# Altium project MainFCC_PCB.PrjPcb (part 2 of 2)

## Sheet Test.SchDoc: Test
size A4; SheetNumber: 12; SheetTotal: 13
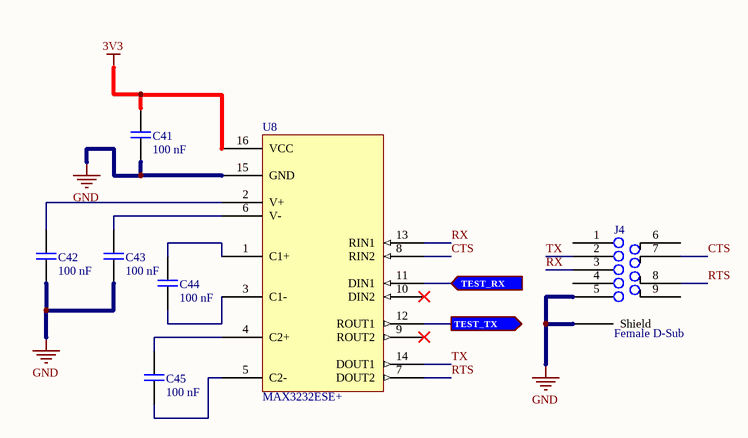
[diagram p9: Test.SchDoc]

### Parts
C41  100 nF  [MergenElektronik_Capacitors_Ceramics_SMDs_0603_M_NS]
C42  100 nF  [MergenElektronik_Capacitors_Ceramics_SMDs_0603_M_NS]
C43  100 nF  [MergenElektronik_Capacitors_Ceramics_SMDs_0603_M_NS]
C44  100 nF  [MergenElektronik_Capacitors_Ceramics_SMDs_0603_M_NS]
C45  100 nF  [MergenElektronik_Capacitors_Ceramics_SMDs_0603_M_NS]
J4  Female D-Sub  [MergenElektronik_Libraries_Connectors_D-Sub_9Position]
U8  MAX3232ESE+  [MergenElektronik_Interfaces_RS232s_SOIC-16]

### Ports
TEST_RX (in, see Microcontroller[4B]), TEST_TX (out, see Microcontroller[3B])

### Nets
3V3: C41.1 U8.16(VCC)
GND: C41.2 C42.2 C43.2 J4.5 J4.Shield U8.15(GND)
CTS: J4.7 U8.8(RIN2)
RTS: J4.8 U8.7(DOUT2)
RX: J4.3 U8.13(RIN1)
TX: J4.2 U8.14(DOUT1)
NetC42_1: C42.1 U8.2(V+)
NetC43_1: C43.1 U8.6(V-)
NetC44_1: C44.1 U8.1(C1+)
NetC44_2: C44.2 U8.3(C1-)
NetC45_1: C45.1 U8.4(C2+)
NetC45_2: C45.2 U8.5(C2-)
NetJ1_3: U8.12(ROUT1) ; port TEST_TX
NetJ1_6: U8.11(DIN1) ; port TEST_RX

Not connected (* = marked no-connect by the designer): J4 1 4 6 9; U8 9(ROUT2)* 10(DIN2)*

### Notes on the sheet
- Title:
- Size:
- Date:
- A4
- Number:
- Time:
- Revision:
- Sheet
- of
- Project
- Drawn By :

### Library data of the parts
C41-C45 = MergenElektronik_Capacitors_Ceramic_SMDs_100nF_100V: Mergen Elektronik - Capacitors - Ceramics - SMDs - 0603 - 100 nF - 100V; Manufacturer: Samsung Electro-Mechanics; Manufacturer Number: CL10B104KC8NNNC; Model: Ceramic Capacitors; Tolerance: ±10%; Value: 100 nF; Temperature: -55°C up to +125°C; Digi-Key Number: 1276-6807-1-ND; Package: 0603(1608 Metric); Mouser Number: 187-CL10B104KC8NNNC; Mounting Type: Surface Mount; Farnell Number: 3013412; Özdisan Number: CL10B104KC8NNNC; Supplier 1: Digikey; Supplier 2: Mouser; Supplier Part Number 1: 1276-6807-1-ND; Supplier Part Number 2: 187-CL10B104KC8NNNC; Voltage Rating: 100V
J4 = MergenElekttronik_Connectors_D-Sub_Female_9Position: Mergen Elektronik - Connectors - D-Sub - Female 9 Position; Manufacturer: Assmann WSW Components; Manufacturer Number: A-DF 09 A/KG-T2S; Model: D-Sub 9 Position Female Connector; Value: A-DF 09 A/KG-T2S; Number of Postion: 9; Current Rating: 3A; Voltage Rating: 250V; Connector Style: D-Sub; Number of Rows: 2; Connector Type: Female; Temperature: -55°C up to 105°C; Mounting Type: THT; Digi-Key Number: AE10921-ND; Supplier 1: Digi-kEY; Supplier Part Number 1: AE10921-ND
U8 = MergenElektronik_Interfaces_RS232s_MAX3232ESE+: Mergen Elektronik - Interfaces - RS232s - MAX3232ESE+; Manufacturer: Analog Devices Inc./Maxim Integrated; Model: RS232 Interfaces; Protocol: RS232; Operating Supply Voltage: 3V up to 5.5V; Manufacturer Number: MAX3232ESE+; Value: MAX3232ESE+; Mounting Type: Surface Mount; Package: SOIC-16; Temperature: -40°C up to 85°C; Mouser Number: 700-MAX3232ESE; Farnell Number: 2519459; Supplier 1: Digi-Key; Supplier Part Number 1: MAX3232ESE+-ND; Supplier 2: Mouser; Supplier Part Number 2: 700-MAX3232ESE; Digi-Key Number: MAX3232ESE+-ND

## Sheet MOSFETs.SchDoc: MOSFETs
size A4; SheetNumber: 13; SheetTotal: 13
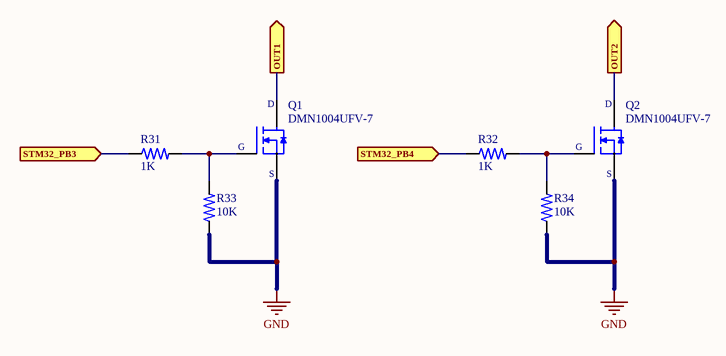
[diagram p10: MOSFETs.SchDoc]

### Parts
Q1  DMN1004UFV-7  [MergenElektronik_Transistors_Mosfets_8-PowerVDFN]
Q2  DMN1004UFV-7  [MergenElektronik_Transistors_Mosfets_8-PowerVDFN]
R31  1K  [MergenElektronik_Resistors_ChipResistors_0603_M_NS]
R32  1K  [MergenElektronik_Resistors_ChipResistors_0603_M_NS]
R33  10K  [MergenElektronik_Resistors_ChipResistors_0603_M_NS]
R34  10K  [MergenElektronik_Resistors_ChipResistors_0603_M_NS]

### Ports
OUT1 (out), OUT2 (out), STM32_PB3 (in, see Microcontroller[3C]), STM32_PB4 (in, see Microcontroller[3C])

### Nets
GND: Q1.2,_3,_4(Source) Q2.2,_3,_4(Source) R33.1 R34.1
NetQ1_1: Q1.1(Gate) R31.2 R33.2
NetQ1_5: Q1.5(Drain) ; port OUT1
NetQ2_1: Q2.1(Gate) R32.2 R34.2
NetQ2_5: Q2.5(Drain) ; port OUT2
NetR31_1: R31.1 ; port STM32_PB3
NetR32_1: R32.1 ; port STM32_PB4

### Notes on the sheet
- Title:
- Size:
- Date:
- A4
- Number:
- Time:
- Revision:
- Sheet
- of
- Project
- Drawn By :
- (in symbol MergenElektronik_Transistors_Mosfets_DMN1004UFV-7) D; G; S

### Library data of the parts
Q1 Q2 = MergenElektronik_Transistors_Mosfets_DMN1004UFV-7: Mergen Elektronik - Transistors - Mosfets - DMN1004UFV-7; Manufacturer: onsemi; Voltage Rating: 12V; Model: Mosfet; Id: 70A; Value: DMN1004UFV-7; Temperature: -55°C up to +150°C (TJ); Digi-Key Number: DMN1004UFV-7DITR-ND; Manufacturer Number: DMN1004UFV-7; Package: 8-PowerVDFN; Mounting Type: Surface Mount; Vdss: 12V; Rating Current: 70A; Mouser Number: 621-DMN1004UFV-7; Farnell Number: 3518380; Supplier 1: Digi-Key; Supplier 2: Mouser; Supplier Part Number 1: DMN1004UFV-7; Supplier Part Number 2: 621-DMN1004UFV-7; Current Rating: 70A
R31 R32 = MergenElektronik_Resistors_ChipResistors_0603_1K: Mergen Elektronik - Resistors - Chip Resistors - 0603 - 1K; Manufacturer: Stackpole Electronics Inc; Manufacturer Number: RMCF0603JT1K00; Value: Chip Resistor - 0603 - 1K; Power: 1/10W; Tolerance: ±5%; Package: 0603(1608); Temperature: -55°C up to +155°C - X8R; Model: Chip Resistor; Digi-Key Number: RMCF0603JT1K00CT-ND; Mounting Type: Surface Mount; Mouser Number: 708-RMCF0603JT1K00; Supplier 1: Digikey; Supplier 2: Mouser; Supplier Part Number 1: RMCF0603JT1K00DKR-ND; Supplier Part Number 2: 708-RMCF0603JT1K00
R33 R34 = MergenElektronik_Resistors_ChipResistors_0603_10K: Mergen Elektronik - Resistors - Chip Resistors - 0603 - 10K; Manufacturer: Stackpole Electronics Inc; Manufacturer Number: RMCF0603JT10K0; Value: Chip Resistor - 0603 - 10K; Power: 1/10W; Tolerance: ±5%; Package: 0603(1608); Temperature: -55°C up to +155°C - X8R; Model: Chip Resistor; Digi-Key Number: RMCF0603JT10K0CT-ND; Mounting Type: Surface Mount; Supplier 1: Digi-Key; Supplier Part Number 1: RMCF0603JT10K0-ND

## Sheet Descriptions.SchDoc
size A4; SheetNumber: 2; SheetTotal: 13
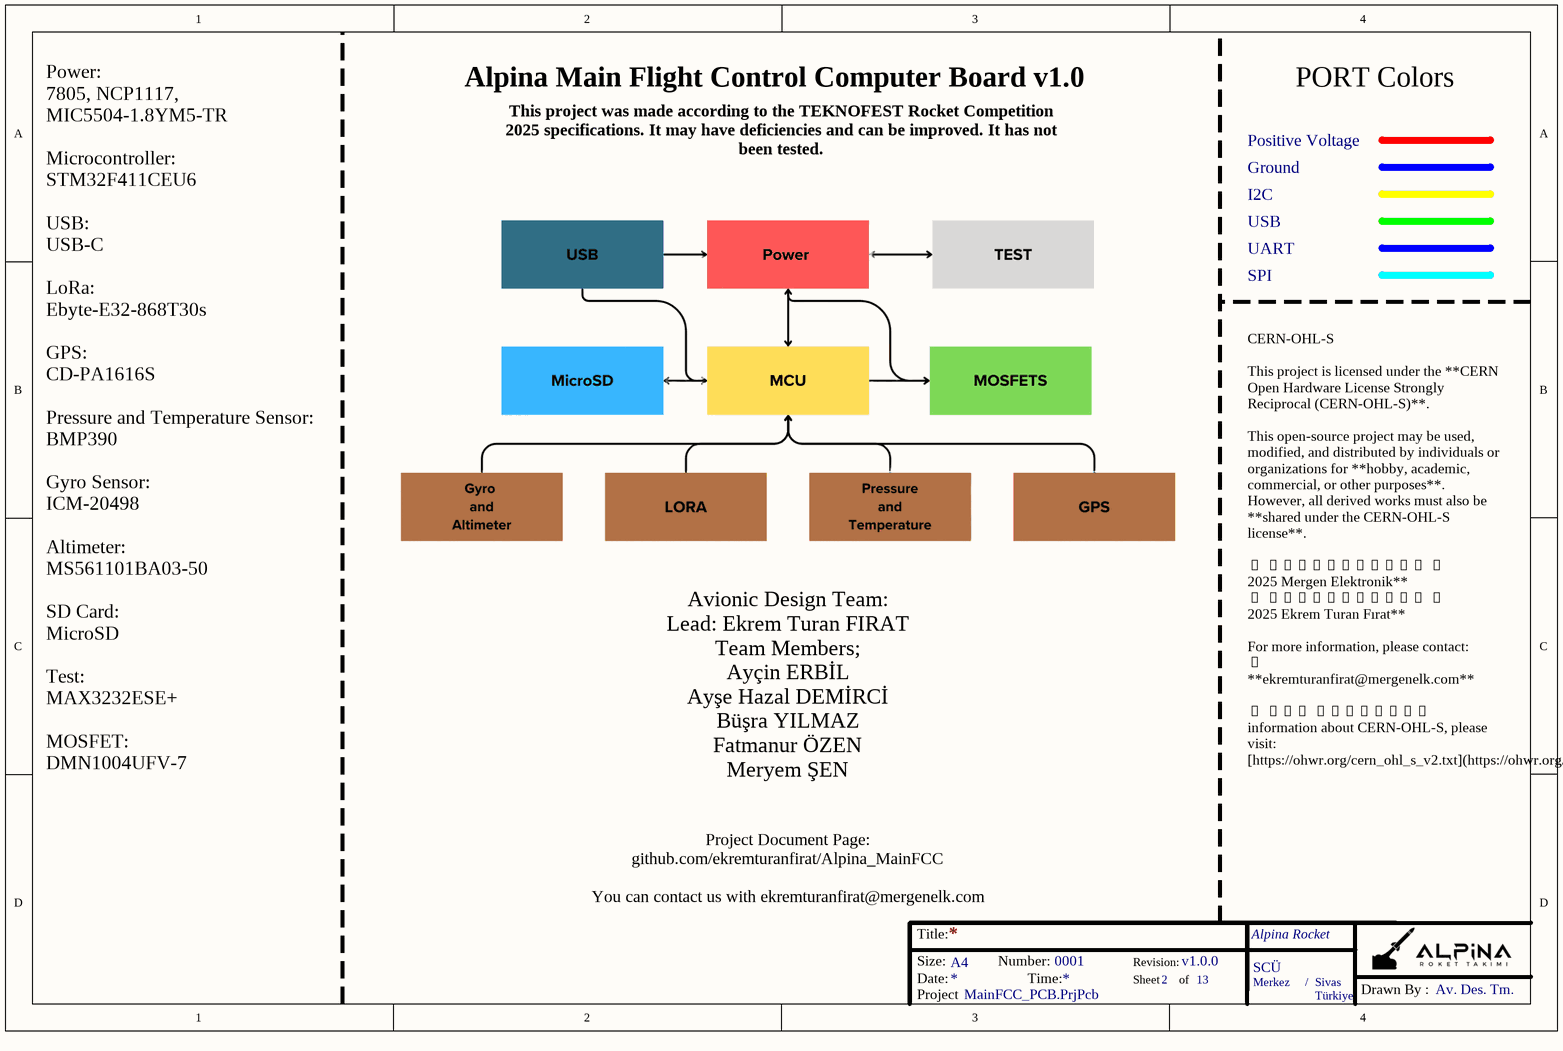
[diagram p11: Descriptions.SchDoc]

### Notes on the sheet
- PORT Colors
- Alpina Main Flight Control Computer Board v1.0
- Positive Voltage
- Ground
- This project was made according to the TEKNOFEST Rocket Competition 2025 specifications. It may have deficiencies and can be improved. It has not been tested.
- I2C
- USB
- UART
- SPI
- Avionic Design Team:
  Lead: Ekrem Turan FIRAT
  Team Members;
  Ayçin ERBİL
  Ayşe Hazal DEMİRCİ
  Büşra YILMAZ
  Fatmanur ÖZEN
  Meryem ŞEN
- CERN-OHL-S
  This project is licensed under the **CERN Open Hardware License Strongly Reciprocal (CERN-OHL-S)**.
  This open-source project may be used, modified, and distributed by individuals or organizations for **hobby, academic, commercial, or other purposes**. However, all derived works must also be **shared under the CERN-OHL-S license**.
  📜 **Copyright © 2025 Mergen Elektronik**
  📜 **Copyright © 2025 Ekrem Turan Fırat**
  For more information, please contact: 📩 **ekremturanfirat@mergenelk.com**
  🔗 For detailed information about CERN-OHL-S, please visit: [https://ohwr.org/cern_ohl_s_v2.txt](https://ohwr.org/cern_ohl_s_v2.txt)
- Power:
  7805, NCP1117, MIC5504-1.8YM5-TR
  Microcontroller:
  STM32F411CEU6
  USB:
  USB-C
  LoRa:
  Ebyte-E32-868T30s
  GPS:
  CD-PA1616S
  Pressure and Temperature Sensor:
  BMP390
  Gyro Sensor:
  ICM-20498
  Altimeter:
  MS561101BA03-50
  SD Card:
  MicroSD
  Test:
  MAX3232ESE+
  MOSFET:
  DMN1004UFV-7
- Project Document Page: github.com/ekremturanfirat/Alpina_MainFCC
  You can contact us with ekremturanfirat@mergenelk.com
- Title:
- Size:
- Date:
- A4
- Number:
- Time:
- Revision:
- Sheet
- of
- Project
- Drawn By :

## Sheet SDCard.SchDoc: SD Card Connection
size A4; SheetNumber: 11; SheetTotal: 13
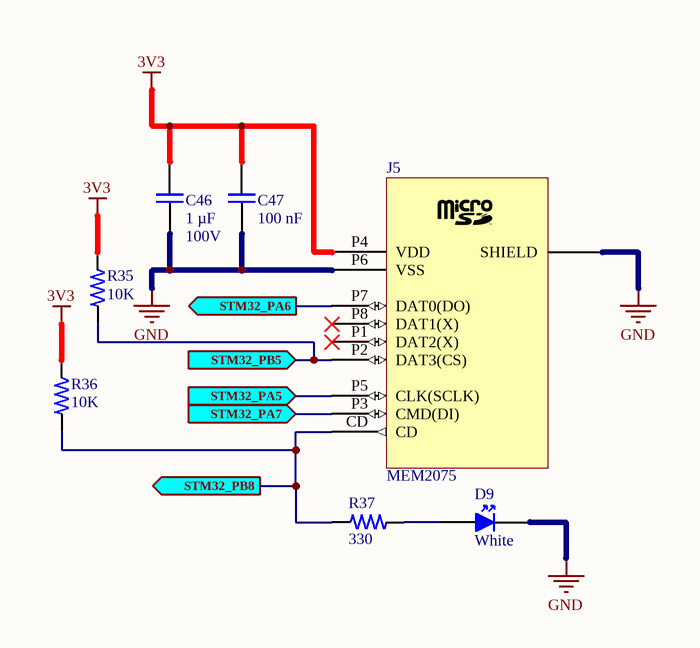
[diagram p12: SDCard.SchDoc]

### Parts
C46  1 µF  Voltage Rating: 100V  [MergenElektronik_Capacitors_Ceramics_SMDs_1206_M_NS]
C47  100 nF  [MergenElektronik_Capacitors_Ceramics_SMDs_0603_M_NS]
D9  White  [MergenElektronik_Leds_SMDs_0603_M_NS]
J5  MEM2075  [MergenElektronik_Connectors_MicroSD_MEM2075]
R35  10K  [MergenElektronik_Resistors_ChipResistors_0603_M_NS]
R36  10K  [MergenElektronik_Resistors_ChipResistors_0603_M_NS]
R37  330  [MergenElektronik_Resistors_ChipResistors_0603_M_NS]

### Ports
STM32_PA5 (in, see Microcontroller[2C]), STM32_PA6 (out, see Microcontroller[2C]), STM32_PA7 (in, see Microcontroller[2C]), STM32_PB5 (in, see Microcontroller[3C]), STM32_PB8 (out, see Microcontroller[3C])

### Nets
3V3: C46.1 C47.1 J5.P4(VDD) R35.1 R36.1
GND: C46.2 C47.2 D9.2(KATOT) J5.P6(VSS) J5.SHIELD
NetD9_1: D9.1(ANOT) R37.2
NetJ5_CD: J5.CD R36.2 R37.1 ; port STM32_PB8
NetJ5_P2: J5.P2(DAT3(CS)) R35.2 ; port STM32_PB5
NetJ5_P3: J5.P3(CMD(DI)) ; port STM32_PA7
NetJ5_P5: J5.P5(CLK(SCLK)) ; port STM32_PA5
NetJ5_P7: J5.P7(DAT0(DO)) ; port STM32_PA6

Not connected (* = marked no-connect by the designer): J5 P1(DAT2(X))* P8(DAT1(X))*

### Notes on the sheet
- Title:
- Size:
- Date:
- A4
- Number:
- Time:
- Revision:
- Sheet
- of
- Project
- Drawn By :

### Library data of the parts
C46 = MergenElektronik_Capacitors_Ceramic_SMDs_1µF_100V: Mergen Elektronik - Capacitors - Ceramics - SMDs - 1206 - 1 µF - 100V; Manufacturer: Samsung Electro-Mechanics; Manufacturer Number: CL31B105KCHNNNE; Model: Ceramic Capacitors; Tolerance: ±10%; Value: 1 µF; Temperature: -55°C up to +125°C; Digi-Key Number: 1276-1838-1-ND; Package: 1206(3216 Metric); Mouser Number: 187-CL31B105KCHNNNE; Mounting Type: Surface Mount; Özdisan Number: CL31B105KCHNNNE; Supplier 1: Digikey; Supplier 2: Mouser; Supplier Part Number 1: 1276-1838-1-ND; Supplier Part Number 2: 187-CL31B105KCHNNNE
C47 = MergenElektronik_Capacitors_Ceramic_SMDs_100nF_100V: as C41 on sheet Test; Value: 100 nF; Temperature: -55°C up to +125°C; Digi-Key Number: 1276-6807-1-ND; Package: 0603(1608 Metric); Mouser Number: 187-CL10B104KC8NNNC; Mounting Type: Surface Mount; Farnell Number: 3013412; Özdisan Number: CL10B104KC8NNNC; Supplier 1: Digikey; Supplier 2: Mouser; Supplier Part Number 1: 1276-6807-1-ND; Supplier Part Number 2: 187-CL10B104KC8NNNC; Voltage Rating: 100V
D9 = MergenElektronik_LEDs_SMDs_White_0603: Mergen Elektronik - Leds - SMDs - White - 0603; Manufacturer: Harvatek Corporation; Manufacturer Number: B1931TW--20P000314U1930; Voltage Rating: 3.2V; Model: SMD Leds; Value: White; Temperature: -40°C up to +85°C; Digi-Key Number: 3147-B1931TW--20P000314U1930CT-ND; Package: 0603(1608); Mounting Type: Surface Mount; Color: White; Supplier 1: Digi-Key; Supplier Part Number 1: 3147-B1931TW--20P000314U1930TR-ND
J5 = MergenElektronik_Connectors_MicroSD_MEM2075: Mergen Elektronik - Connectors - SD Card Connectors - MEM2075; Manufacturer: GCT; Manufacturer Number: MEM2075-00-140-01-A; Voltage Rating: 30VDC/AC; Current Rating: 500 mA per pin.; Farnell Number: 2895610; Value: MEM2075; Model: Micro SD; Temperature: -25°C up to +85°C; Package: MEM2075; Mounting Type: Surface Mount; Mouser Number: 640-MEM20750014001A; Digi-Key Number: 2073-MEM2075-00-140-01-ACT-ND; Supplier 1: Digi-Key; Supplier Part Number 1: 2073-MEM2075-00-140-01-ADKR-ND; Supplier 2: Mouser; Supplier Part Number 2: 640-MEM20750014001A
R35 R36 = MergenElektronik_Resistors_ChipResistors_0603_10K: as R33 on sheet MOSFETs; Package: 0603(1608); Temperature: -55°C up to +155°C - X8R; Model: Chip Resistor; Digi-Key Number: RMCF0603JT10K0CT-ND; Mounting Type: Surface Mount; Supplier 1: Digi-Key; Supplier Part Number 1: RMCF0603JT10K0-ND
R37 = MergenElektronik_Resistors_ChipResistors_0603_330R: Mergen Elektronik - Resistors - Chip Resistors - 0603 - 330R; Manufacturer: Stackpole Electronics Inc; Manufacturer Number: RMCF0603JT330R; Value: Chip Resistor - 0603 - 330R; Power: 1/10W; Tolerance: ±5%; Package: 0603(1608); Temperature: -55°C up to +155°C - X8R; Model: Chip Resistor; Digi-Key Number: RMCF0603JT330RCT-ND; Mounting Type: Surface Mount; Supplier 1: Digi-Key; Supplier Part Number 1: RMCF0603JT330RCT-ND

## Nets that join several sheets
1V8: Power (C8.1 IC3.5 R3.1), Gyro (7 pins)
3V3: Power (6 pins), Microcontroller (17 pins), USB (R8.2 R9.2), PressureandTemperature (9 pins), Gyro (5 pins), GPS (FB1.1 R22.1 R23.1 U5.4), Altimeter (6 pins), LoRa (C38.1 C39.1 R30.1 U7.2), Test (C41.1 U8.16), SDCard (5 pins)
GND: Power (14 pins), Microcontroller (25 pins), USB (13 pins), PressureandTemperature (5 pins), Gyro (7 pins), GPS (10 pins), Altimeter (C37.2 U6.3), LoRa (9 pins), Test (6 pins), MOSFETs (Q1.2, 3, 4 Q2.2, 3, 4 R33.1 R34.1), SDCard (5 pins)
VBUS: Power (D3.1), USB (C25.1 C26.1 C27.1 L1.1)
NetJ1_1: Microcontroller (J1.1), GPS (R24.2)
NetJ1_3: Microcontroller (J1.3), Test (U8.12)
NetJ1_4: Microcontroller (J1.4), GPS (R25.2)
NetJ1_6: Microcontroller (J1.6), Test (U8.11)
NetJ5_CD: Microcontroller (U1.45), SDCard (J5.CD R36.2 R37.1)
NetJ5_P2: Microcontroller (U1.41), SDCard (J5.P2 R35.2)
NetJ5_P3: Microcontroller (U1.17), SDCard (J5.P3)
NetJ5_P5: Microcontroller (U1.15), SDCard (J5.P5)
NetJ5_P7: Microcontroller (U1.16), SDCard (J5.P7)
NetR14_1: Microcontroller (U1.42), PressureandTemperature (R14.1 U2.2), Gyro (R20.1 U4.6), GPS (R22.2 U5.14), Altimeter (R28.1 U6.8)
NetR15_1: Microcontroller (U1.43), PressureandTemperature (R15.1 U2.4), Gyro (R21.1 U4.5), GPS (R23.2 U5.15), Altimeter (R29.1 U6.7)
NetR31_1: Microcontroller (U1.39), MOSFETs (R31.1)
NetR32_1: Microcontroller (U1.40), MOSFETs (R32.1)
NetU1_18: Microcontroller (U1.18), LoRa (U7.6)
NetU1_19: Microcontroller (U1.19), LoRa (U7.7)
NetU1_30: Microcontroller (U1.30), LoRa (U7.5)
NetU1_31: Microcontroller (U1.31), LoRa (U7.4)
USB_N: Microcontroller (U1.32), USB (R11.2)
USB_P: Microcontroller (U1.33), USB (R10.2)